# Altium schematic sheet Rth.SchDoc
size A; SheetNumber: 2; SheetTotal: 2
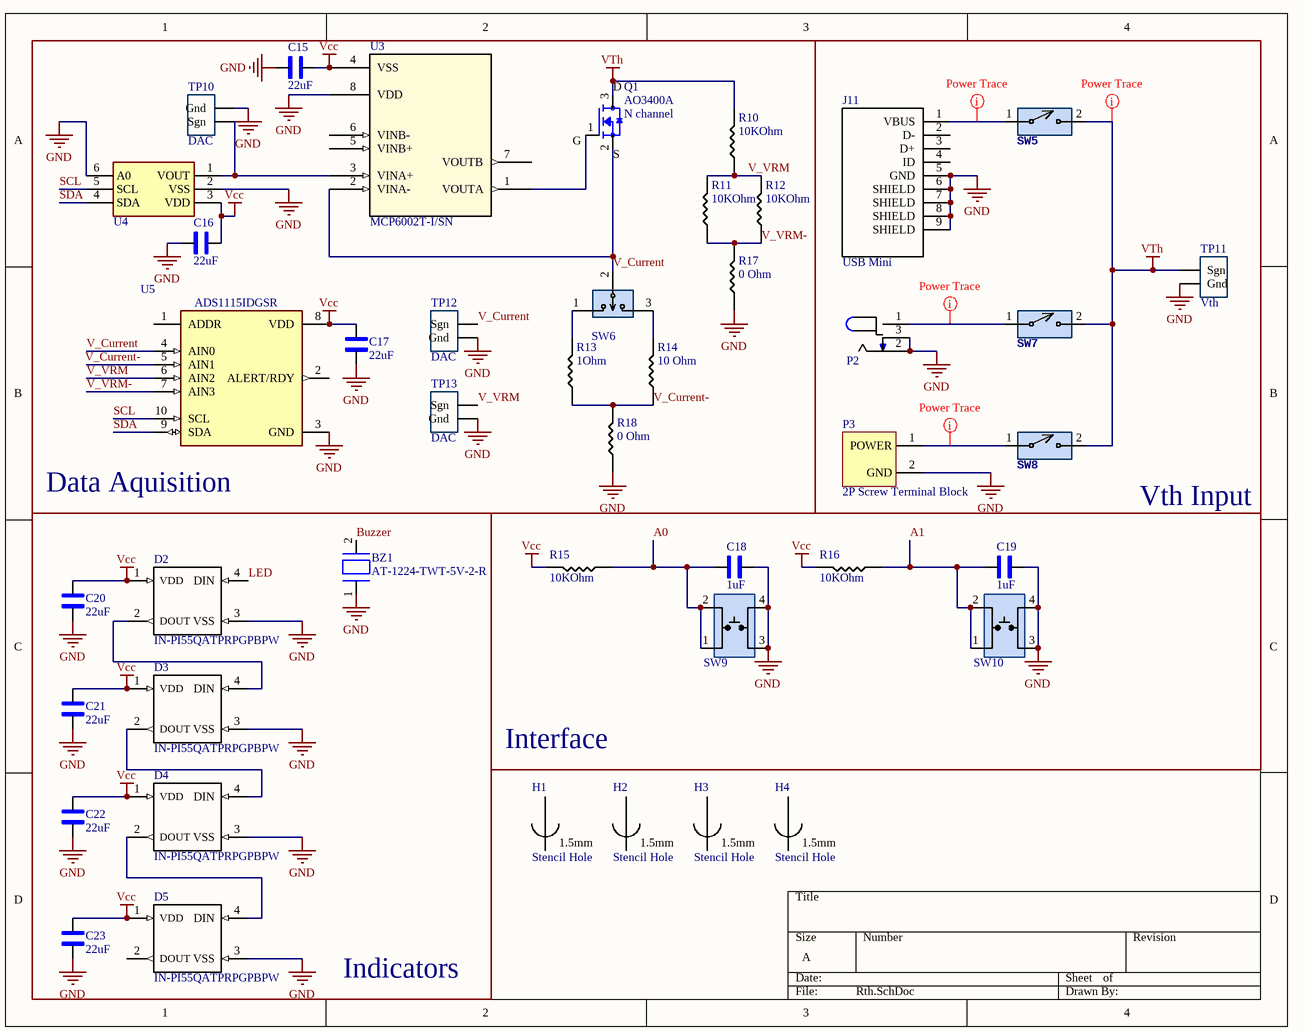
[diagram p0: Rth.SchDoc]

## Parts
BZ1  AT-1224-TWT-5V-2-R  [BUZZER- TH]
C15  22uF  [1206_Passive_Capacitor]
C16  22uF  [1206_Passive_Capacitor]
C17  22uF  [1206_Passive_Capacitor]
C18  1uF  [1206_Passive_Capacitor]
C19  1uF  [1206_Passive_Capacitor]
C20  22uF  [1206_Passive_Capacitor]
C21  22uF  [1206_Passive_Capacitor]
C22  22uF  [1206_Passive_Capacitor]
C23  22uF  [1206_Passive_Capacitor]
D2  IN-PI55QATPRPGPBPW  [SERIAL_LED - duplicate]
D3  IN-PI55QATPRPGPBPW  [SERIAL_LED - duplicate]
D4  IN-PI55QATPRPGPBPW  [SERIAL_LED - duplicate]
D5  IN-PI55QATPRPGPBPW  [SERIAL_LED - duplicate]
H1  Stencil Hole  [AlignmentHole_1.5mm]
H2  Stencil Hole  [AlignmentHole_1.5mm]
H3  Stencil Hole  [AlignmentHole_1.5mm]
H4  Stencil Hole  [AlignmentHole_1.5mm]
J11  USB Mini  [USB_MINI_B]
P2  Power Jack  [Power_Jack]  (value not drawn)
P3  2P Screw Terminal Block  [P_Terminal block 3.5mm-pitch]
Q1  AO3400A  value N channel  [N-MOSFET]
R10  value 10KOhm  [1206_Passive_Resitor]  (hidden comment: 10k)
R11  value 10KOhm  [1206_Passive_Resitor]  (hidden comment: 10k)
R12  value 10KOhm  [1206_Passive_Resitor]  (hidden comment: 10k)
R13  value 1Ohm  [1206_Passive_Resitor]  (hidden comment: 1 Ohm)
R14  10 Ohm  [1206_Passive_Resitor]
R15  value 10KOhm  [1206_Passive_Resitor]  (hidden comment: 10k)
R16  value 10KOhm  [1206_Passive_Resitor]  (hidden comment: 10k)
R17  0 Ohm  [1206_Passive_Resitor]
R18  0 Ohm  [1206_Passive_Resitor]
SW5  SW_2Pin_100mil_Switch  [2Pin-Header-Conn]  (value not drawn)
SW6  PREC003SAAN-RC  [3_PIN_100mil]  (value not drawn)
SW7  SW_2Pin_100mil_Switch  [2Pin-Header-Conn]  (value not drawn)
SW8  SW_2Pin_100mil_Switch  [2Pin-Header-Conn]  (value not drawn)
SW9  TL3305AF160QG  [Switch_JLC]  (value not drawn)
SW10  TL3305AF160QG  [Switch_JLC]  (value not drawn)
TP10  DAC  [TP10x_Probe]
TP11  Vth  [TP10x_Probe]
TP12  DAC  [TP10x_Probe]
TP13  DAC  [TP10x_Probe]
U3  MCP6002T-I/SN  [SOIC127P600X175-8N]
U4  DAC IC  [MCP4725]  (value not drawn)
U5  ADS1115IDGSR  [ADC_ADS1115IDGSR]

## Blocks framed on the sheet
Data Aquisition: C15-C17 Q1 R10-R14 R17 R18 SW6 TP10 TP12 TP13 U3-U5
Vth Input: J11 P2 P3 SW5 SW7 SW8 TP11

## Nets
GND: BZ1.1(BZ1) C15.1 C16.1 C17.1 C18.1 C19.1 C20.1 C21.1 C22.1 C23.1 D2.3(VSS) D3.3(VSS) D4.3(VSS) D5.3(VSS) J11.5(GND) J11.6(SHIELD) J11.7(SHIELD) J11.8(SHIELD) J11.9(SHIELD) P2.2 P2.3 P3.2(GND) R17.1 R18.1 SW9.3 SW9.4 SW10.3 SW10.4 TP10.2(Gnd) TP11.2(Gnd) TP12.2(Gnd) TP13.2(Gnd) U3.8(VDD) U4.2(VSS) U4.6(A0) U5.3(GND)
Vcc: C15.2 C16.2 C17.2 C20.2 C21.2 C22.2 C23.2 D2.1(VDD) D3.1(VDD) D4.1(VDD) D5.1(VDD) R15.2 R16.2 U3.4(VSS) U4.3(VDD) U5.8(VDD)
VTh: Q1.3(D) R10.2 SW5.2 SW7.2 SW8.2 TP11.1(Sgn)
A0: C18.2 R15.1 SW9.1 SW9.2
A1: C19.2 R16.1 SW10.1 SW10.2
Buzzer: BZ1.2(BZ2)
LED: D2.4(DIN)
SCL: U4.5(SCL) U5.10(SCL)
SDA: U4.4(SDA) U5.9(SDA)
V_Current: Q1.2(S) SW6.2 TP12.1(Sgn) U3.2(VINA-) U5.4(AIN0)
V_Current-: R13.1 R14.1 R18.2
V_VRM: R10.1 R11.2 R12.2 TP13.1(Sgn) U5.6(AIN2)
V_VRM-: R11.1 R12.1 R17.2 U5.7(AIN3)
NetD2_2: D2.2(DOUT) D3.4(DIN)
NetD3_2: D3.2(DOUT) D4.4(DIN)
NetD4_2: D4.2(DOUT) D5.4(DIN)
NetJ11_1: J11.1(VBUS) SW5.1
NetP2_1: P2.1 SW7.1
NetP3_1: P3.1(POWER) SW8.1
NetQ1_1: Q1.1(G) U3.1(VOUTA)
NetR13_2: R13.2 SW6.1
NetR14_2: R14.2 SW6.3
NetTP10_1: TP10.1(Sgn) U3.3(VINA+) U4.1(VOUT)

Not connected (* = marked no-connect by the designer): D5 2(DOUT); J11 2(D-) 3(D+) 4(ID); U3 5(VINB+) 6(VINB-) 7(VOUTB); U5 1(ADDR) 2(ALERT/RDY) 5(AIN1)

## Layout directives
rule Width Constraint [Pref Width = 20mil    Min Width = 10mil    Max Width = 100mil]: NetJ11_1, NetP2_1, NetP3_1, VTh

## Notes on the sheet
- Interface
- Indicators
- Labels drawn without touching a wire or pin: V_Current-
- (in symbol H_StencilAllignment_1.5mm) 1.5mm

## Library data of the parts
BZ1 = BUZZER_1: Buzzers Transducer, Externally Driven Electromechanical/Magnetic 5 V 40mA 2.4kHz 87dB @ 5V, 10cm Through Hole PC Pins; Datasheet: https://www.puiaudio.com/media/SpecSheet/AT-1224-TWT-5V-2-R.pdf; MFR Part #: AT-1224-TWT-5V-2-R
C15-C17 C20-C23 = C_22uF_1206: 22uF ±10% 25V X5R 1206 Multilayer Ceramic Capacitors MLCC - SMD/SMT RoHS; MFR Part #: CL31A226KAHNNNE; Type: basic; LCSC Part#: C12891; Datasheet: https://datasheet.lcsc.com/lcsc/1811031514_Samsung-Electro-Mechanics-CL31A226KAHNNNE_C12891.pdf; Value: 22uF
C18 C19 = C_1uF_1206: MULTILAYER CERAMIC CAPACITORS MLCC - SMD/SMT 1UF 50V 1206 ROHS; MFR Part #: CL31B105KBHNNNE; Type: Basic; Digikey Link: https://www.digikey.com/product-detail/en/C1206C105M4RACTU/399-8150-1-ND/3471873/?itemSeq=304982366; LCSC Part#: C1848; Value: 1uF
D2-D5 = LED_Smart: LIGHT EMITTING DIODES (LED) RGB 620~630NM RED, 520~530NM GREEN, 465~475NM BLUE 600MCD@16MARED,1200MCD@16MAGREEN,300MCD@16MABLUE TOP VIEW SMD-4 ROHS; MFR Part #: IN-PI55QATPRPGPBPW-60; Manufacturer: Inolux; LCSC Part#: C2761795; DataSheet: https://datasheet.lcsc.com/lcsc/2106062036_Worldsemi-WS2812B-B-W_C2761795.pdf
H1-H4 = H_StencilAllignment_1.5mm: Stencil Allignment hole for use with 1.5mm pin
J11 = J_USB_B_Mini: Through Hole USB Connectors RoHS; MFR Part #: 920-462A2021D10102; Value: USB mini B; LCSC Part#: C46398; Datasheet: https://datasheet.lcsc.com/szlcsc/2103081233_Jing-Extension-of-the-Electronic-Co-920-462A2021D10102_C46398.pdf; Type: Extended
P2 = P_Power Jack: Power Barrel Connector Jack 2.10mm ID (0.083"), 5.50mm OD (0.217") Through Hole, Right Angle; MFR Part #: PJ-102A; Value: CONN PWR JACK 2X5.5MM SOLDER; Digikey Link: https://www.digikey.com/product-detail/en/PJ-102A/CP-102A-ND/275425/?itemSeq=304982367; LCSC Part#: C136744; Type: Extended
P3 = P_Terminal block: Green Straight pin 3.5mm  pitch; P=3.5mm  Screw terminal ROHS; MFR Part #: KF350-3.5-2P; Manufacturer: Cixi Kefa Elec; LCSC Part#: C474892; DataSheet: https://datasheet.lcsc.com/lcsc/2001160007_Cixi-Kefa-Elec-KF350-3-5-2P_C474892.pdf
Q1 = Q_Nch_MOSFET: MOSFET N Trench 30V 5.7A 1.5V @ 250uA 26.5 m? @ 5.7A,10V SOT-23-3L RoHS; Type: Basic; LCSC Part#: C20917; Datasheet: https://datasheet.lcsc.com/szlcsc/Alpha-Omega-Semicon-AOS-AO3400A_C20917.pdf; MFR Part #: AO3400A
R10-R12 R15 R16 = R_10KOhm_1206: 10 kOhms ±5% 0.25W, 1/4W Chip Resistor 1206 (3216 Metric) Automotive AEC-Q200 Thick Film; MFR Part #: RMCF1206FT10K0; Digikey Link: https://www.digikey.com/en/products/detail/stackpole-electronics-inc/RMCF1206FT10K0/1759669; LCSC Part#: C17902; Type: Basic
R13 = R_1Ohm_1206: 1Ω ±5% 0.25W ±400ppm/℃ 1206 Chip Resistor - Surface Mount RoHS; MFR Part #: 1206W4J010JT5E; LCSC Part#: C1409; Datasheet: https://datasheet.lcsc.com/lcsc/1810301410_UNI-ROYAL-Uniroyal-Elec-1206W4J010JT5E_C1409.pdf; Type: Extended
R14 = R_10Ohm_1206: CHIP RESISTOR - SURFACE MOUNT 0.1OHMS ±1% 1/4W 1206 ROHS; MFR Part #: 1206W4F100JT5E; Datasheet: https://datasheet.lcsc.com/szlcsc/Uniroyal-Elec-1206W4F100JT5E_C17903.pdf; LCSC Part#: C17903; Type: Basic; Value: 10 Ohm
R17 R18 = R_0Ohm_1206: CHIP RESISTOR - SURFACE MOUNT 0OHMS ±1% 1/4W 1206 ROHS; MFR Part #: 1206W4F0000T5E; Datasheet: https://datasheet.lcsc.com/szlcsc/Uniroyal-Elec-1206W4F0000T5E_C17888.pdf; LCSC Part#: C17888; Type: Basic; Mouser link: https://www.mouser.com/ProductDetail/Royalohm/1206W4F0000T5E?qs=e8oIoAS2J1Thbopin%252BsagQ%3D%3D; Value: 0 Ohm
SW5 SW7 SW8 = SW_2Pin_100mil_Switch: 2Pin Header; LCSC Part#: C124375; Type: Extended
SW6 = SW_3Pin_100mil_Switch: Connector Header Through Hole 3 position 0.100" (2.54mm); Value: CONN HEADER VERT 3POS 2.54MM; Digikey Link: https://www.digikey.com/product-detail/en/PREC003SAAN-RC/S1012EC-03-ND/2774851/?itemSeq=304982371; MFR Part #: PREC003SAAN-RC; Type: Extended; LCSC Part#: C49257
SW9 SW10 = SW_Push_Button_JLC: Tactile Switch SPST-NO Top Actuated Surface Mount; MFR Part #: KH-4.5X4.5X4.3H-STM; LCSC Part#: C2837550; Type: Extended; DataSheet: https://datasheet.lcsc.com/lcsc/2106081532_Shenzhen-Kinghelm-Elec-KH-4.5X4.5X4.3H-STM_C2837550.pdf
TP10-TP13 = TP_10x_Probe: Test Point 300 mil centers
U3 = U_MCP6002T-I/SN: 0.6 V/us 2 1MHz 1.8V ~ 6V 100μA General Purpose SOIC-8_150mil  Operational Amplifier ROHS; Mfr: Microchip; MFR Part #: MCP6002T-I/SN; DataSheet: https://ww1.microchip.com/downloads/en/DeviceDoc/MCP6001-1R-1U-2-4-1-MHz-Low-Power-Op-Amp-DS20001733L.pdf; LCSC Part#: C7377; Type: Basic
U4 = U_MCP4725A0T-E/CH: IC DAC 12BIT V-OUT SOT23-6; Datasheet: https://ww1.microchip.com/downloads/en/DeviceDoc/22039d.pdf; LCSC Part#: C144198; type: Extended; MFR Part #: MCP4725A0T-E/CH
U5 = U_ADC_ADS1115IDGSR: 16-Bit ADC with Integrated MUX, PGA, Comparator, Oscillator, and Reference 10-VSSOP -40 to 125; MFR Part #: ADS1115IDGSR; Package: MSOP-10 Texas Instruments; LCSC Part#: C37593; SnapEDA_Link: https://www.snapeda.com/parts/ADS1115IDGSR/Texas%20Instruments/view-part/?ref=snap; Type: Extended; DigiKey link: https://www.digikey.com/product-detail/en/texas-instruments/ADS1115IDGSR/296-38849-1-ND/5142969?utm_source=snapeda&utm_medium=aggregator&utm_campaign=symbol; Value: *